# Altium schematic sheet QCopterCAM_PWM_Sch.SchDoc
size A4
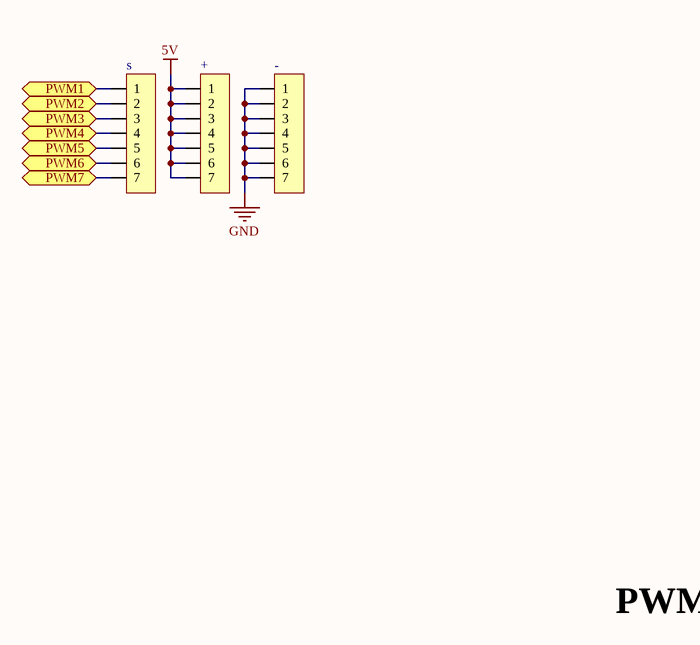
[diagram p0: QCopterCAM_PWM_Sch.SchDoc]

## Parts
+  HDR1X7_180_2.54  [HDR1X7_180_2.54]  (value not drawn)
-  HDR1X7_180_2.54  [HDR1X7_180_2.54]  (value not drawn)
s  HDR1X7_180_2.54  [HDR1X7_180_2.54]  (value not drawn)

## Ports
PWM1, PWM2, PWM3, PWM4, PWM5, PWM6, PWM7

## Nets
5V: +.1 +.2 +.3 +.4 +.5 +.6 +.7
GND: -.1 -.2 -.3 -.4 -.5 -.6 -.7
PWM1: s.1 ; port PWM1
PWM2: s.2 ; port PWM2
PWM3: s.3 ; port PWM3
PWM4: s.4 ; port PWM4
PWM5: s.5 ; port PWM5
PWM6: s.6 ; port PWM6
PWM7: s.7 ; port PWM7

## Notes on the sheet
- PWM

## Library data of the parts
+ - s = HDR1X7_180_2.54: Header